# EAGLE design 1 (EAGLE 8.5.0)
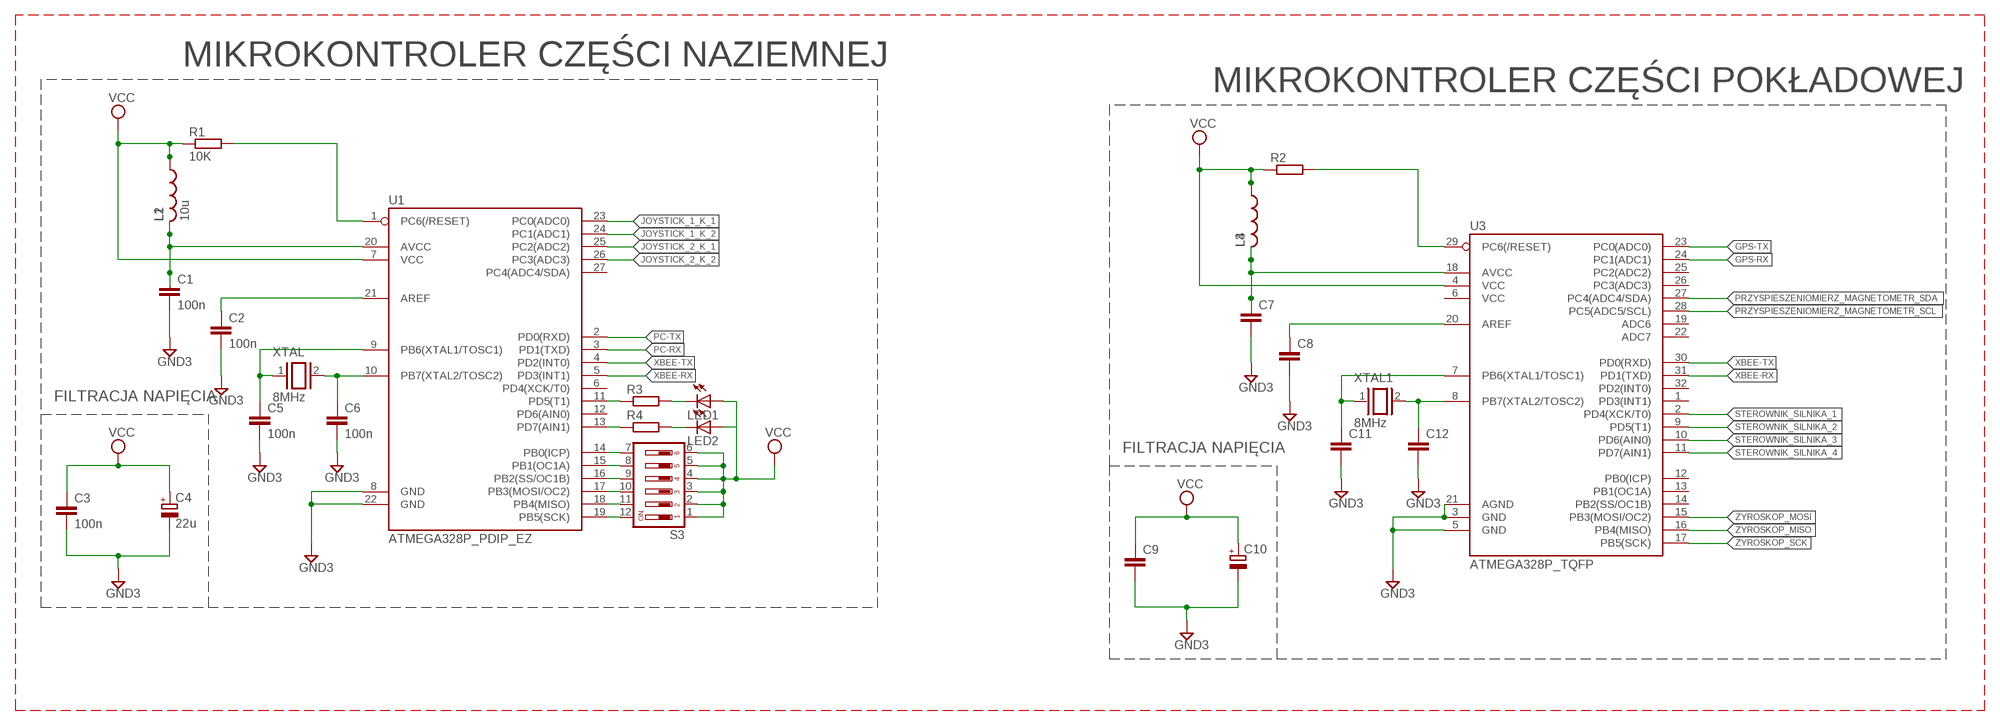
[diagram p0: schematic, sheet 1]

## Parts
C1  100n  C-EU050-025X075  [C050-025X075]
C2  100n  C-EU050-025X075  [C050-025X075]
C3  100n  C-EU050-025X075  [C050-025X075]
C4  22u  CPOL-EUB45181A  [B45181A]
C5  100n  C-EU050-025X075  [C050-025X075]
C6  100n  C-EU050-025X075  [C050-025X075]
C7  C-EU050-025X075  [C050-025X075]
C8  C-EU050-025X075  [C050-025X075]
C9  C-EU050-025X075  [C050-025X075]
C10  CPOL-EUB45181A  [B45181A]
C11  C-EU050-025X075  [C050-025X075]
C12  C-EU050-025X075  [C050-025X075]
L1  L-US0207/10  [0207/10]
L2  10u  L-US0207/10  [0207/10]
L3  L-US0207/10  [0207/10]
L4  L-US0207/10  [0207/10]
LED1  LEDIRL80A  [IRL80A]
LED2  LEDIRL80A  [IRL80A]
R1  10K  R-EU_0204/5  [0204/5]
R2  R-EU_0204/5  [0204/5]
R3  R-EU_0204/5  [0204/5]
R4  R-EU_0204/5  [0204/5]
S3  SD4-06  [SD4-06]
U1  ATMEGA328P_PDIP_EZ  [DIP28-SIMON-KIT]
U3  ATMEGA328P_TQFP  [TQFP32-08]
XTAL  8MHz  XTAL  [Q]
XTAL1  8MHz  XTAL  [Q]

## Nets
GND3: C1.2 C2.2 C3.2 C4.- C5.2 C6.2 C7.2 C8.2 C9.2 C10.- C11.2 C12.2 U1.8(GND) U1.22(GND) U3.3(GND) U3.5(GND) U3.21(AGND)
GPS-RX: U3.24(PC1(ADC1))
GPS-TX: U3.23(PC0(ADC0))
JOYSTICK_1_K_1: U1.23(PC0(ADC0))
JOYSTICK_1_K_2: U1.24(PC1(ADC1))
JOYSTICK_2_K_1: U1.25(PC2(ADC2))
JOYSTICK_2_K_2: U1.26(PC3(ADC3))
N$1: R1.2 U1.1(PC6(/RESET))
N$2: C1.1 L1.2 L2.2 U1.20(AVCC)
N$3: C2.1 U1.21(AREF)
N$4: R2.2 U3.29(PC6(/RESET))
N$5: C6.1 U1.10(PB7(XTAL2/TOSC2)) XTAL.2
N$6: C5.1 U1.9(PB6(XTAL1/TOSC1)) XTAL.1
N$7: C7.1 L3.2 L4.2 U3.18(AVCC)
N$8: C8.1 U3.20(AREF)
N$9: C12.1 U3.8(PB7(XTAL2/TOSC2)) XTAL1.2
N$10: C11.1 U3.7(PB6(XTAL1/TOSC1)) XTAL1.1
N$11: LED1.K(C) R3.2
N$12: S3.7 U1.14(PB0(ICP))
N$13: S3.8 U1.15(PB1(OC1A))
N$14: S3.9 U1.16(PB2(SS/OC1B))
N$15: S3.10 U1.17(PB3(MOSI/OC2))
N$16: S3.11 U1.18(PB4(MISO))
N$17: S3.12 U1.19(PB5(SCK))
N$19: LED2.K(C) R4.2
N$20: R4.1 U1.13(PD7(AIN1))
N$21: R3.1 U1.11(PD5(T1))
PRZYSPIESZENIOMIERZ_MAGNETOMETR_SCL: U3.28(PC5(ADC5/SCL))
PRZYSPIESZENIOMIERZ_MAGNETOMETR_SDA: U3.27(PC4(ADC4/SDA))
STEROWNIK_SILNIKA_1: U3.2(PD4(XCK/T0))
STEROWNIK_SILNIKA_2: U3.9(PD5(T1))
STEROWNIK_SILNIKA_3: U3.10(PD6(AIN0))
STEROWNIK_SILNIKA_4: U3.11(PD7(AIN1))
VCC: C3.1 C4.+ C9.1 C10.+ L1.1 L2.1 L3.1 L4.1 LED1.A LED2.A R1.1 R2.1 S3.1 S3.2 S3.3 S3.4 S3.5 S3.6 U1.7(VCC) U3.4(VCC)
XBEE-RX: U3.31(PD1(TXD))
XBEE-TX: U3.30(PD0(RXD))
ŻYROSKOP_MISO: U3.16(PB4(MISO))
ŻYROSKOP_MOSI: U3.15(PB3(MOSI/OC2))
ŻYROSKOP_SCK: U3.17(PB5(SCK))
Unconnected: U1.2(PD0(RXD)) U1.3(PD1(TXD)) U1.4(PD2(INT0)) U1.5(PD3(INT1)) U1.6(PD4(XCK/T0)) U1.12(PD6(AIN0)) U1.27(PC4(ADC4/SDA)) U3.1(PD3(INT1)) U3.6(VCC) U3.12(PB0(ICP)) U3.13(PB1(OC1A)) U3.14(PB2(SS/OC1B)) U3.19(ADC6) U3.22(ADC7) U3.25(PC2(ADC2)) U3.26(PC3(ADC3)) U3.32(PD2(INT0))

## Notes on the sheet
- MIKROKONTROLER CZĘŚCI NAZIEMNEJ
- MIKROKONTROLER CZĘŚCI POKŁADOWEJ
- FILTRACJA NAPIĘCIA
- FILTRACJA NAPIĘCIA

## Library data of the parts
C1-C3 C5-C9 C11 C12 = rcl:C-EU: CAPACITOR, European symbol; SPICEPREFIX: C
C4 C10 = rcl:CPOL-EU: POLARIZED CAPACITOR, European symbol; SPICEPREFIX: C
L1-L4 = rcl:L-US: INDUCTOR, American symbol; SPICEPREFIX: L
LED1 LED2 = adafruit:LED: LED OSRAM: - CHIPLED LG R971, LG N971, LY N971, LG Q971, LY Q971, LO R971, LY R971 LH N974, LH R974 LS Q976, LO Q976, LY Q976 LO Q996 - Hyper CHIPLED LW Q18S LB Q993, LB Q99A, LB R99A - SideLED LS A670, LO A670, LY A670, LG A670, LP A670 LB A673, LV A673, LT A673, LW A673 LH A674 LY A675 LS A676, LA A676, LO A676, LY A676, LW A676 LS A679, LY A679, LG A679 - Hyper Micro SIDELED® LS Y876, LA Y876, LO Y876, LY Y876 LT Y87S - SmartLED LW L88C, LW L88S LB L89C, LB L89S, LG L890 LS L89K, LO L89K, LY L89K LS L896, LA L896, LO L896, LY L896 - TOPLED LS T670, LO T670, LY T670, LG T670, LP T670 LSG T670, LSP T670, LSY T670, LOP T670, LYG T670 LG T671, LOG T671, LSG T671 LB T673, LV T673, LT T673, LW T673 LH T674 LS T676, LA T676, LO T676, LY T676, LB T676, LH T676, LSB T676, LW T676 LB T67C, LV T67C, LT T67C, LS T67K, LO T67K, LY T67K, LW E67C LS E67B, LA E67B, LO E67B, LY E67B, LB E67C, LV E67C, LT E67C LW T67C LS T679, LY T679, LG T679 LS T770, LO T770, LY T770, LG T770, LP T770 LB T773, LV T773, LT T773, LW T773 LH T774 LS E675, LA E675, LY E675, LS T675 LS T776, LA T776, LO T776, LY T776, LB T776 LHGB T686 LT T68C, LB T68C - Hyper Mini TOPLED® LB M676 - Mini TOPLED Santana® LG M470 LS M47K, LO M47K, LY M47K Source: http://www.osram.convergy.de/
R1-R4 = rcl:R-EU_: RESISTOR, European symbol; SPICEPREFIX: R
S3 = switch-dil:SD4-06: DIL/CODE SWITCH; OC_FARNELL: unknown; OC_NEWARK: unknown
U1 = SparkFun-IC-Microcontroller:ATMEGA328P_PDIP_EZ: Keyed ATMEGA328 DIP This is a version of the DIP package with pin 28 clipped to prevent reverse insertion. See regular 328 for product references.
U3 = SparkFun-IC-Microcontroller:ATMEGA328P_TQFP: Popular 328P in QFP Storefront component: ATmega328 - TQFP <https://www.sparkfun.com/products/13448> (COM-13448) Datasheet <http://www.sparkfun.com/datasheets/Components/SMD/ATMega328.pdf> SparkFun Products SparkFun RedBoard - Programmed with Arduino <https://www.sparkfun.com/products/12757> (DEV-12757) Arduino Pro Mini 328 - 5V/16MHz <https://www.sparkfun.com/products/11113> (DEV-11113) Arduino Pro Mini 328 - 3.3V/8MHz <https://www.sparkfun.com/products/11114> (DEV-11114) SparkFun OpenLog <https://www.sparkfun.com/products/13712> (DEV-13712) SparkFun MicroView - OLED Arduino Module <https://www.sparkfun.com/products/12923> (DEV-12923) SparkFun Digital Sandbox <https://www.sparkfun.com/products/12651> (DEV-12651) SparkFun PicoBoard <https://www.sparkfun.com/products/11888> (WIG-11888) Arduino Fio <https://www.sparkfun.com/products/10116> (DEV-10116) LilyPad Arduino 328 Main Board <https://www.sparkfun.com/products/13342> (DEV-13342) SparkFun RedStick <https://www.sparkfun.com/products/13741> (DEV-13741) LilyPad MP3 <https://www.sparkfun.com/products/11013> (DEV-11013) LilyPad Arduino SimpleSnap <https://www.sparkfun.com/products/10941> (DEV-10941) SparkFun Stepoko <https://www.sparkfun.com/products/13899> (ROB-13899) SparkFun Geiger Counter <https://www.sparkfun.com/products/11345> (SEN-11345) SparkFun EL Sequencer <https://www.sparkfun.com/products/12781> (COM-12781) Arduino Pro 328 - 5V/16MHz <https://www.sparkfun.com/products/10915> (DEV-10915) CryptoCape <https://www.sparkfun.com/products/12773> (DEV-12773) SparkFun IR Thermometer Evaluation Board - MLX90614 <https://www.sparkfun.com/products/10740> (SEN-10740) SparkFun RedBot Mainboard <https://www.sparkfun.com/products/12097> (ROB-12097) Arduino Pro 328 - 3.3V/8MHz <https://www.sparkfun.com/products/10914> (DEV-10914) SparkFun Block for Intel® Edison - Arduino <https://www.sparkfun.com/products/13036> (DEV-13036) SparkFun Simon Says - Surface Mount Soldering Kit <https://www.sparkfun.com/products/10935> (KIT-10935) SparkFun 7-Segment Serial Display - Red <https://www.sparkfun.com/products/11441> (COM-11441) SparkFun 7-Segment Serial Display - White <https://www.sparkfun.com/products/11629> (COM-11629) SparkFun 7-Segment Serial Display - Yellow <https://www.sparkfun.com/products/11443> (COM-11443) SparkFun 7-Segment Serial Display - Kelly Green <https://www.sparkfun.com/products/11440> (COM-11440) SparkFun 7-Segment Serial Display - Blue <https://www.sparkfun.com/products/11442> (COM-11442) SparkFun OpenSegment Serial Display - 20mm (Blue) <https://www.sparkfun.com/products/11647> (COM-11647) SparkFun OpenSegment Serial Display - 20mm (Green) <https://www.sparkfun.com/products/11646> (COM-11646) SparkFun OpenSegment Serial Display - 20mm (White) <https://www.sparkfun.com/products/11648> (COM-11648) SparkFun OpenSegment Serial Display - 20mm (Red) <https://www.sparkfun.com/products/11644> (COM-11644) SparkFun OpenSegment Serial Display - 20mm (Yellow) <https://www.sparkfun.com/products/11645> (COM-11645) SparkFun OpenSegment Shield <https://www.sparkfun.com/products/13190> (DEV-13190); PROD_ID: IC-09069
XTAL XTAL1 = special:XTAL: CRYSTAL

## Board
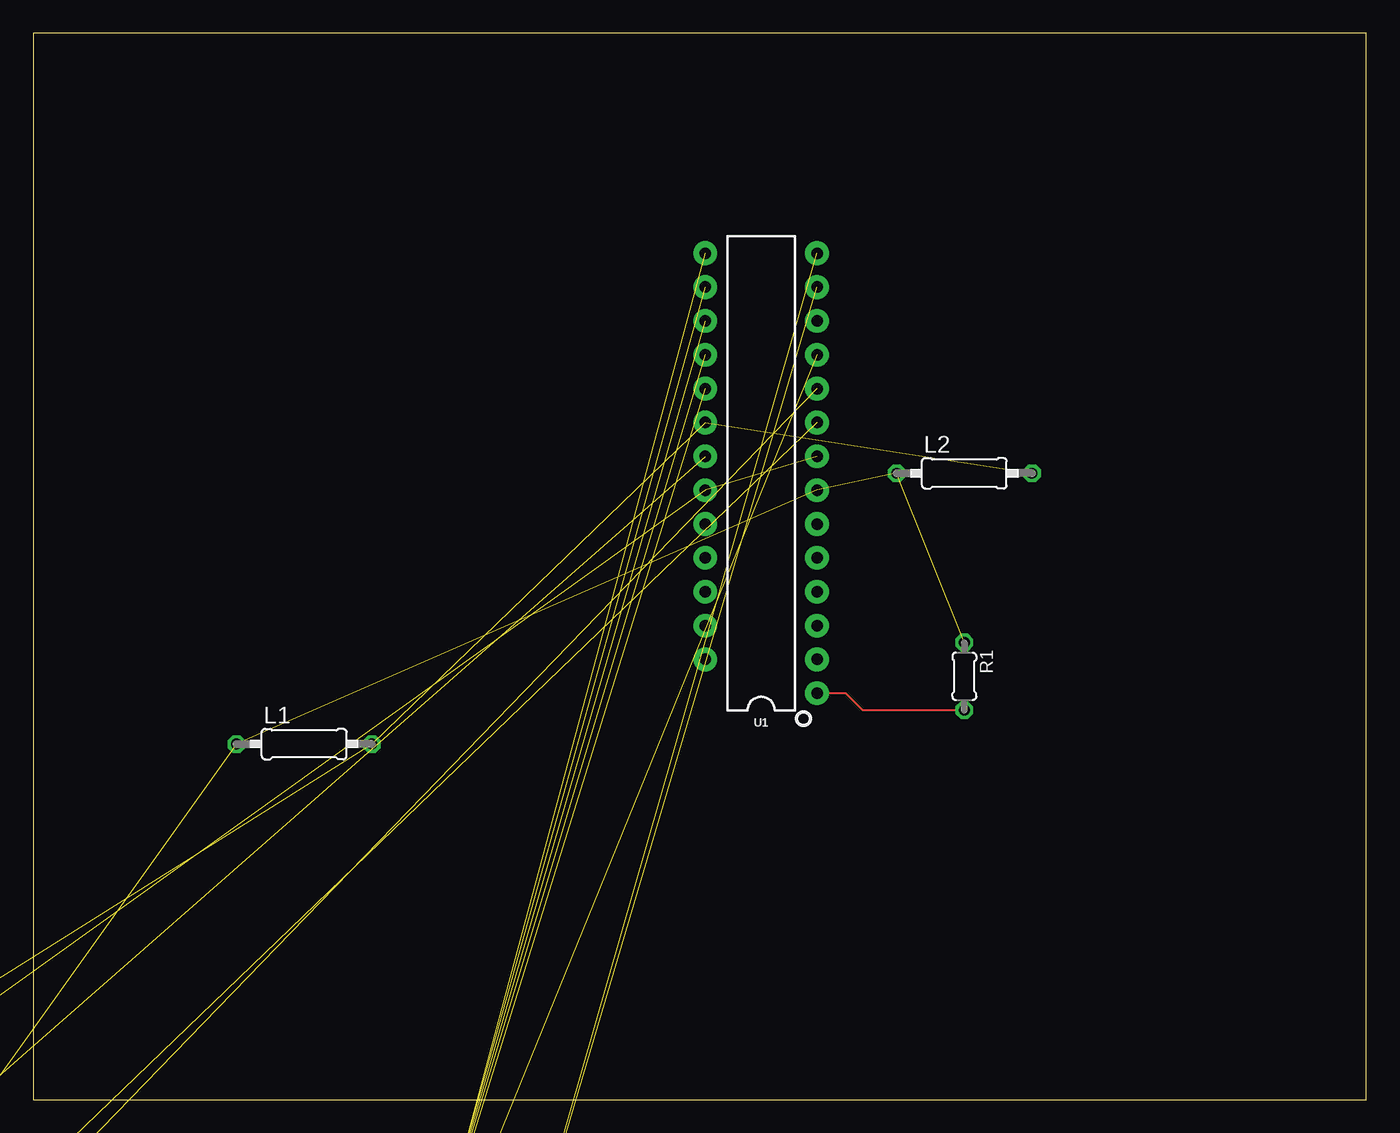
[diagram p1: board, top side]

Size 100 x 80 mm. Coordinates in mm from the lower left corner, seen from the top.
Outline: 0,0 100,0 100,80 0,80 0,0
Copper layers (1*16): Top 0.035mm / dielectric 1.5mm / Bottom 0.035mm
Design rules "default": minimum track width 6mil, minimum drill 0.35mm, track to track 6mil, track to pad 6mil, pad to pad 6mil, via to via 6mil, smd to smd 6mil, copper to edge 40mil, drill to drill 6mil, minimum pad ring 10mil, minimum via ring 8mil, stop-mask expansion 4mil, vias tented up to drill 0mil, thermal gap 10mil

### Footprints (pad centres in the part's own frame; a part is rotated, then mirrored left to right if it is on the bottom)
C050-025X075 = drill 0.813 octagon: 1 -2.54,0; 2 2.54,0
B45181A = drill 0.813 pad 1.6: + -1.27,0 | drill 0.813 pad 1.6 octagon: - 1.27,0
0207/10 = drill 0.813 octagon: 1 -5.08,0; 2 5.08,0
IRL80A = drill 0.813 octagon: A 0,-1.27; K 0,1.27
0204/5 = drill 0.813 octagon: 1 -2.54,0; 2 2.54,0
SD4-06 = drill 0.813 long: 1 -6.35,-3.81; 2 -3.81,-3.81; 3 -1.27,-3.81; 4 1.27,-3.81; 5 3.81,-3.81; 6 6.35,-3.81; 7 6.35,3.81; 8 3.81,3.81; 9 1.27,3.81; 10 -1.27,3.81; 11 -3.81,3.81; 12 -6.35,3.81
DIP28-SIMON-KIT = drill 0.864 pad 1.778: 1 -16.51,-4.191; 2 -13.97,-4.191; 3 -11.43,-4.191; 4 -8.89,-4.191; 5 -6.35,-4.191; 6 -3.81,-4.191; 7 -1.27,-4.191; 8 1.27,-4.191; 9 3.81,-4.191; 10 6.35,-4.191; 11 8.89,-4.191; 12 11.43,-4.191; 13 13.97,-4.191; 14 16.51,-4.191; 15 16.51,4.191; 16 13.97,4.191; 17 11.43,4.191; 18 8.89,4.191; 19 6.35,4.191; 20 3.81,4.191; 21 1.27,4.191; 22 -1.27,4.191; 23 -3.81,4.191; 24 -6.35,4.191; 25 -8.89,4.191; 26 -11.43,4.191; 27 -13.97,4.191
TQFP32-08 = smd 1.27 x 0.559: 1 -4.293,2.8; 2 -4.293,2; 3 -4.293,1.2; 4 -4.293,0.4; 5 -4.293,-0.4; 6 -4.293,-1.2; 7 -4.293,-2; 8 -4.293,-2.8; 17 4.293,-2.8; 18 4.293,-2; 19 4.293,-1.2; 20 4.293,-0.4; 21 4.293,0.4; 22 4.293,1.2; 23 4.293,2; 24 4.293,2.8 | smd 0.559 x 1.27: 9 -2.8,-4.293; 10 -2,-4.293; 11 -1.2,-4.293; 12 -0.4,-4.293; 13 0.4,-4.293; 14 1.2,-4.293; 15 2,-4.293; 16 2.8,-4.293; 25 2.8,4.293; 26 2,4.293; 27 1.2,4.293; 28 0.4,4.293; 29 -0.4,4.293; 30 -1.2,4.293; 31 -2,4.293; 32 -2.8,4.293
Q = drill 0.61 long: 1 -2.54,-7.62; 2 2.54,-7.62

### Placement (x,y rotation side)
C1  -26.67,-7.62 0 top  (outside the outline)
C2  -26.67,-21.59 0 top  (outside the outline)
C3  -26.67,-35.56 0 top  (outside the outline)
C4  -26.67,-50.8 0 top  (outside the outline)
C5  -44.45,-66.04 0 top  (outside the outline)
C6  -44.45,-80.01 0 top  (outside the outline)
C7  -20.32,-140.97 0 top  (outside the outline)
C8  -1.27,-140.97 0 top  (outside the outline)
C9  -44.45,-154.94 0 top  (outside the outline)
C10  -27.94,-121.92 0 top  (outside the outline)
C11  -25.4,-154.94 0 top  (outside the outline)
C12  -6.35,-154.94 0 top  (outside the outline)
L1  20.32,26.67 0 top
L2  69.85,46.99 0 top
L3  -6.35,-120.65 0 top  (outside the outline)
L4  -41.91,-140.97 0 top  (outside the outline)
LED1  -106.68,-308.61 0 top  (outside the outline)
LED2  -77.47,-294.64 0 top  (outside the outline)
R1  69.85,31.75 270 top
R2  -44.45,-168.91 0 top  (outside the outline)
R3  -87.63,-309.88 0 top  (outside the outline)
R4  -44.45,-295.91 0 top  (outside the outline)
S3  -40.64,-264.16 0 top  (outside the outline)
U1  54.61,46.99 90 top
U3  -91.44,-294.64 0 top  (outside the outline)
XTAL  -45.72,-44.45 0 top  (outside the outline)
XTAL1  -45.72,-120.65 0 top  (outside the outline)

### Tracks (layer width: path | path; a pad name or v marks a point on that pad's centre or on a via)
GND3  (16 unrouted)
N$1
  Top 0.152: R1.2 62.23,29.21 60.96,30.48 U1.1
N$2  (3 unrouted)
N$3  (1 unrouted)
N$4  (1 unrouted)
N$5  (2 unrouted)
N$6  (2 unrouted)
N$7  (3 unrouted)
N$8  (1 unrouted)
N$9  (2 unrouted)
N$10  (2 unrouted)
N$11  (1 unrouted)
N$12  (1 unrouted)
N$13  (1 unrouted)
N$14  (1 unrouted)
N$15  (1 unrouted)
N$16  (1 unrouted)
N$17  (1 unrouted)
N$19  (1 unrouted)
N$20  (1 unrouted)
N$21  (1 unrouted)
VCC  (19 unrouted)